# Altium project REFLOW_Controller.PrjPcb (part 1 of 3)
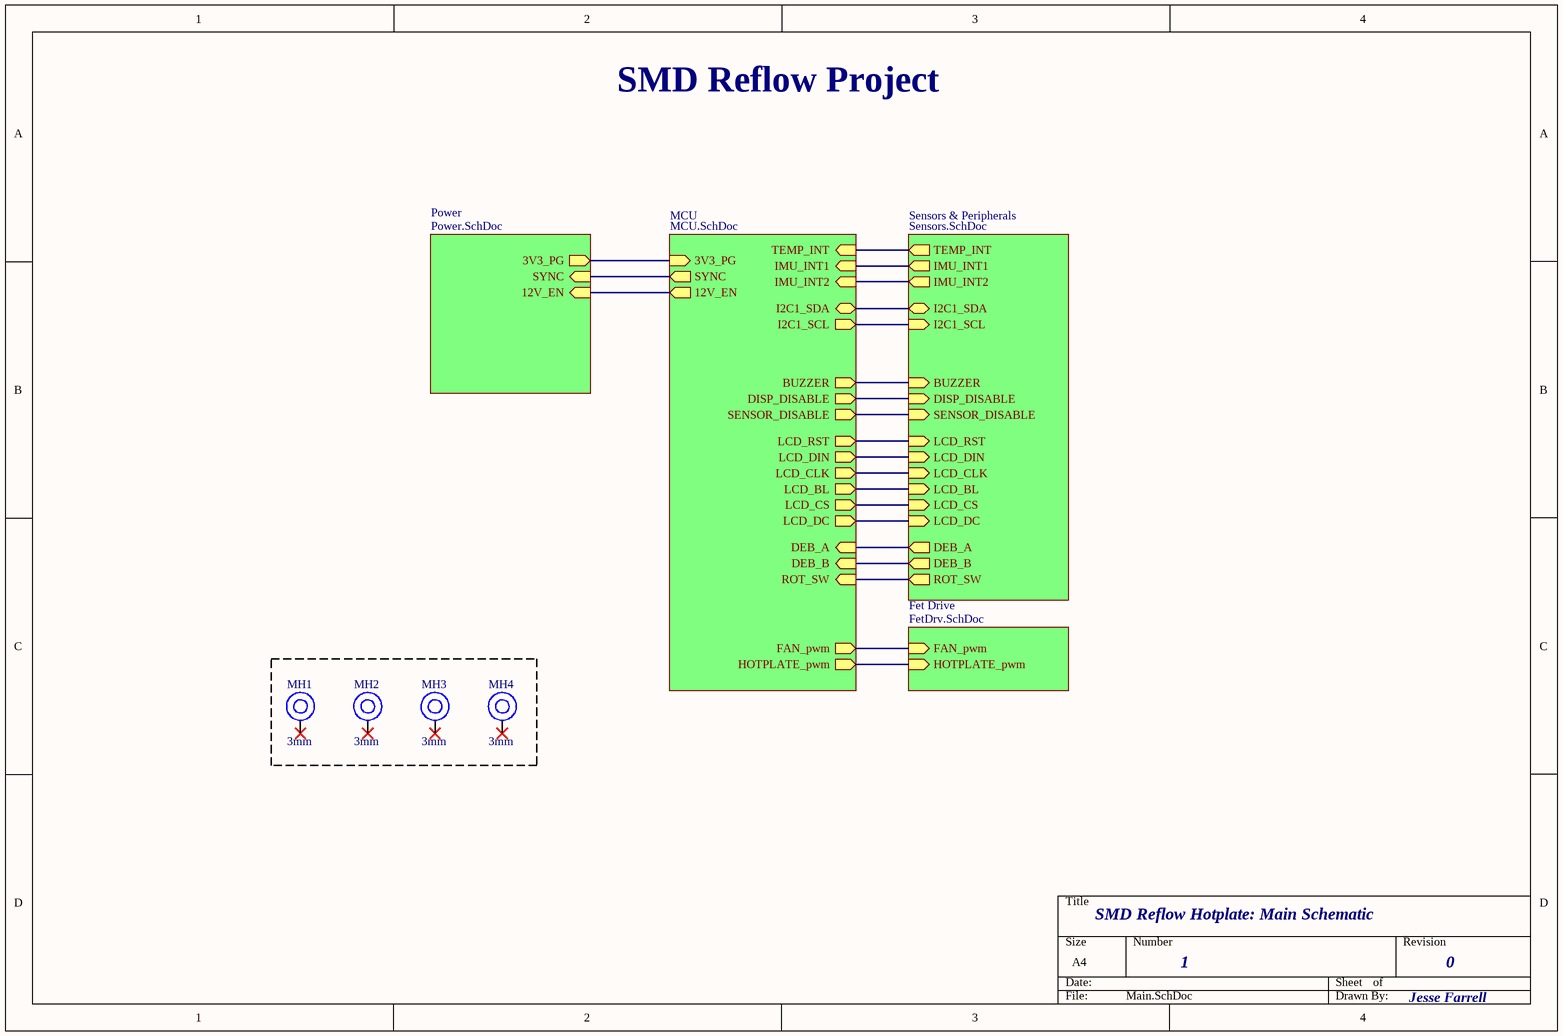
[diagram p0: Main.SchDoc]
5 sheets, 202 parts. Net scope: hierarchical (ports join the sheet entries above them; power ports are global).
Board file: Controller.PcbDoc
Sheets:
  Main.SchDoc
    Power = Power.SchDoc
    MCU = MCU.SchDoc
    Sensors & Peripherals = Sensors.SchDoc
    Fet Drive = FetDrv.SchDoc

## Sheet Main.SchDoc
size A4; SheetNumber: 1; SheetTotal: 5

### Parts
MH1  3mm  [Mount-Hole_3mm]
MH2  3mm  [Mount-Hole_3mm]
MH3  3mm  [Mount-Hole_3mm]
MH4  3mm  [Mount-Hole_3mm]

### Sub-sheets
Fet Drive = FetDrv.SchDoc: FAN_pwm (in), HOTPLATE_pwm (in)
MCU = MCU.SchDoc: SYNC (out), BUZZER (out), 12V_EN (out), 3V3_PG (in), TEMP_INT (in), LCD_CLK (out), LCD_CS (out), LCD_DIN (out), IMU_INT1 (in), LCD_BL (out), LCD_RST (out), LCD_DC (out), ROT_SW (in), DEB_A (in), DEB_B (in), FAN_pwm (out), HOTPLATE_pwm (out), IMU_INT2 (in), I2C1_SCL (out), DISP_DISABLE (out), SENSOR_DISABLE (out), I2C1_SDA (bidir)
Power = Power.SchDoc: 3V3_PG (out), SYNC (in), 12V_EN (in)
Sensors & Peripherals = Sensors.SchDoc: BUZZER (in), TEMP_INT (out), LCD_RST (in), LCD_DIN (in), LCD_CLK (in), LCD_BL (in), LCD_CS (in), LCD_DC (in), DEB_A (out), DEB_B (out), ROT_SW (out), IMU_INT2 (out), IMU_INT1 (out), DISP_DISABLE (in), SENSOR_DISABLE (in), I2C1_SDA (bidir), I2C1_SCL (in)

### Nets
3V3_PG: sheet Power/3V3_PG, sheet MCU/3V3_PG
12V_EN_in: sheet Power/12V_EN, sheet MCU/12V_EN
BUZZER: sheet MCU/BUZZER, sheet Sensors & Peripherals/BUZZER
DEB_A: sheet MCU/DEB_A, sheet Sensors & Peripherals/DEB_A
DEB_B: sheet MCU/DEB_B, sheet Sensors & Peripherals/DEB_B
DISP_DBL: sheet MCU/DISP_DISABLE, sheet Sensors & Peripherals/DISP_DISABLE
FAN_pwm: sheet MCU/FAN_pwm, sheet Fet Drive/FAN_pwm
I2C1_SCL: sheet MCU/I2C1_SCL, sheet Sensors & Peripherals/I2C1_SCL
I2C1_SDA: sheet MCU/I2C1_SDA, sheet Sensors & Peripherals/I2C1_SDA
IMU_INT1: sheet MCU/IMU_INT1, sheet Sensors & Peripherals/IMU_INT1
IMU_INT2: sheet MCU/IMU_INT2, sheet Sensors & Peripherals/IMU_INT2
LCD_BL: sheet MCU/LCD_BL, sheet Sensors & Peripherals/LCD_BL
LCD_CLK: sheet MCU/LCD_CLK, sheet Sensors & Peripherals/LCD_CLK
LCD_CS: sheet MCU/LCD_CS, sheet Sensors & Peripherals/LCD_CS
LCD_DC: sheet MCU/LCD_DC, sheet Sensors & Peripherals/LCD_DC
LCD_DIN: sheet MCU/LCD_DIN, sheet Sensors & Peripherals/LCD_DIN
LCD_RST: sheet MCU/LCD_RST, sheet Sensors & Peripherals/LCD_RST
PLATE_pwm: sheet MCU/HOTPLATE_pwm, sheet Fet Drive/HOTPLATE_pwm
ROT_SW: sheet MCU/ROT_SW, sheet Sensors & Peripherals/ROT_SW
SNS_DBL: sheet MCU/SENSOR_DISABLE, sheet Sensors & Peripherals/SENSOR_DISABLE
SYNC_in: sheet Power/SYNC, sheet MCU/SYNC
TEMP_INT: sheet MCU/TEMP_INT, sheet Sensors & Peripherals/TEMP_INT

Not connected (* = marked no-connect by the designer): MH1 1*; MH2 1*; MH3 1*; MH4 1*

### Notes on the sheet
- SMD Reflow Project
- SMD Reflow Hotplate: Main Schematic
- 1
- 0
- Jesse Farrell

### Library data of the parts
MH1-MH4 = Mount_Hole_3mm: Mounting Hole 3mm plated

## Sheet Power.SchDoc
size A4; SheetNumber: 2; SheetTotal: 5
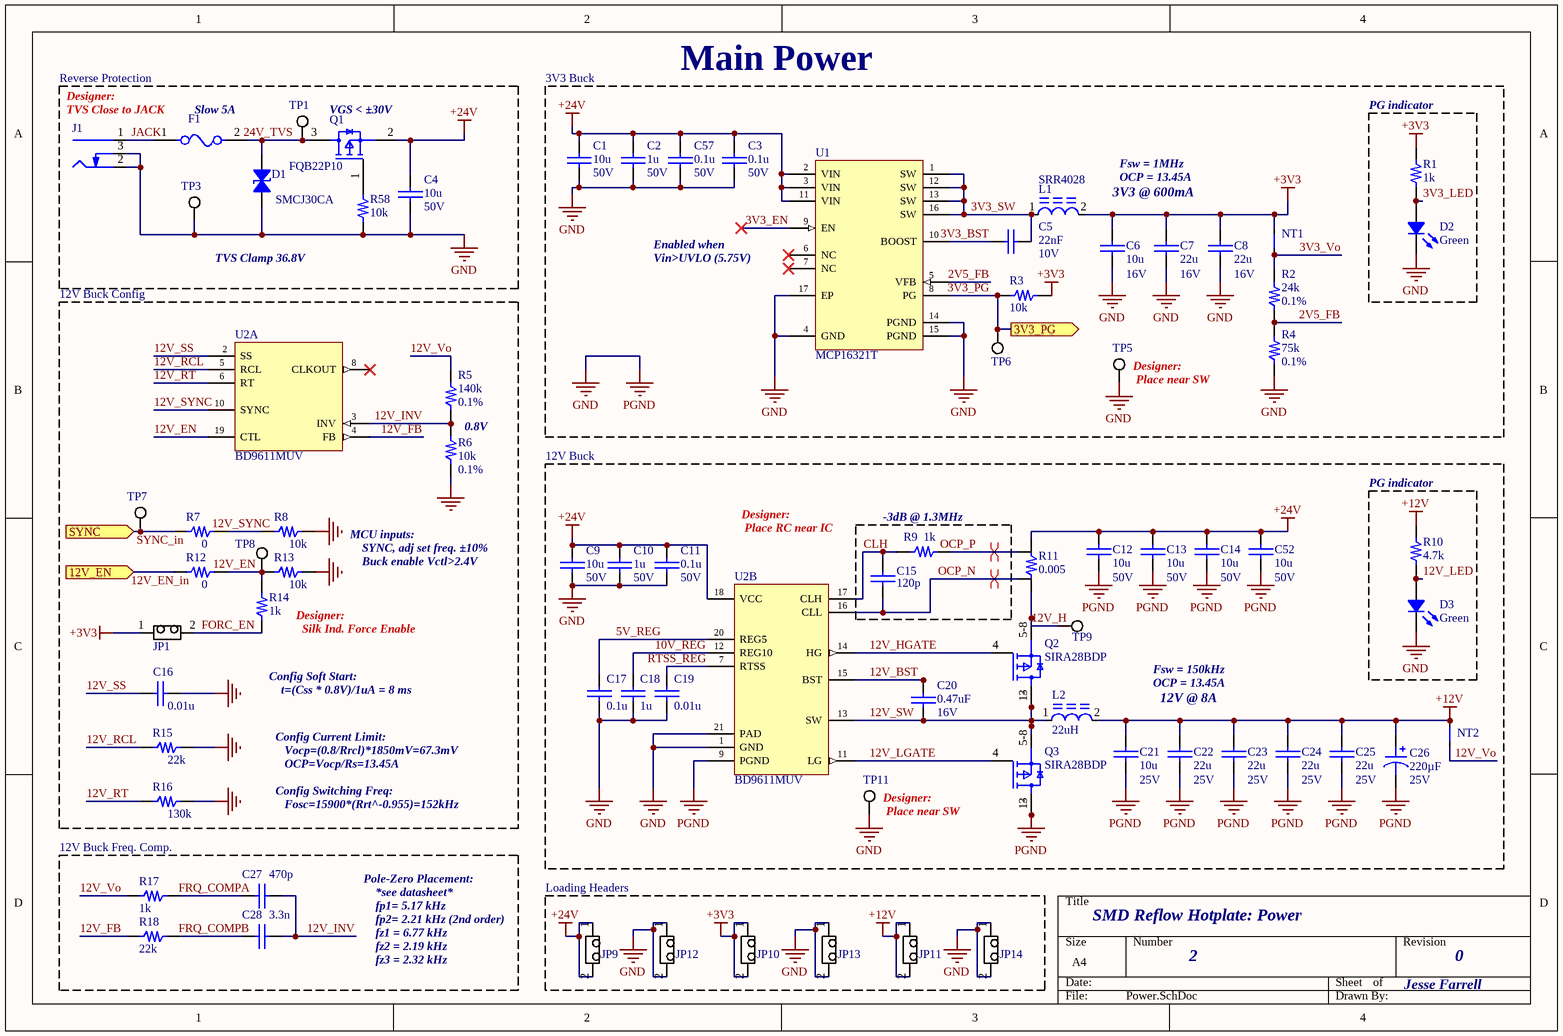
[diagram p1: Power.SchDoc]

### Parts
C1  10u  Voltage Rating: 50V  [FP-CL21-IPC_C]
C2  1u  Voltage Rating: 50V  [FP-CL10-IPC_C]
C3  0.1u  Voltage Rating: 50V  [FP-CL10-IPC_C]
C4  10u  Voltage Rating: 50V  [FP-CL21-IPC_C]
C5  22nF  Voltage Rating: 10V  [FP-CL10-IPC_C]
C6  10u  Voltage Rating: 16V  [FP-CL10-IPC_C]
C7  22u  Voltage Rating: 16V  [FP-CL21-IPC_C]
C8  22u  Voltage Rating: 16V  [FP-CL21-IPC_C]
C9  10u  Voltage Rating: 50V  [FP-CL21-IPC_C]
C10  1u  Voltage Rating: 50V  [FP-CL10-IPC_C]
C11  0.1u  Voltage Rating: 50V  [FP-CL10-IPC_C]
C12  10u  Voltage Rating: 50V  [FP-CL21-IPC_C]
C13  10u  Voltage Rating: 50V  [FP-CL21-IPC_C]
C14  10u  Voltage Rating: 50V  [FP-CL21-IPC_C]
C15  120p  [FP-CL10-IPC_C]
C16  0.01u  [FP-CL10-IPC_C]
C17  0.1u  [FP-CL10-IPC_C]
C18  1u  [FP-CL10-IPC_C]
C19  0.01u  [FP-CL10-IPC_C]
C20  0.47uF  Voltage Rating: 16V  [FP-CL10-IPC_C]
C21  10u  Voltage Rating: 25V  [FP-CL10-IPC_C]
C22  22u  Voltage Rating: 25V  [FP-CL21-IPC_C]
C23  22u  Voltage Rating: 25V  [FP-CL21-IPC_C]
C24  22u  Voltage Rating: 25V  [FP-CL21-IPC_C]
C25  22u  Voltage Rating: 25V  [FP-CL21-IPC_C]
C26  220µF  Voltage - Rated: 25V  [CAP TH ALUM ELEC D8.00mm S3.50mm H13.00mm]
C27  470p  [FP-CL10-IPC_C]
C28  3.3n  [FP-CL10-IPC_C]
C52  10u  Voltage Rating: 50V  [FP-CL21-IPC_C]
C57  0.1u  Voltage Rating: 50V  [FP-CL10-IPC_C]
D1  SMCJ30CA  [DO214AB SMC]
D2  Green  [LED 0603_1608 GREEN]
D3  Green  [LED 0603_1608 GREEN]
F1  SF-1206S600M  [FP-3216FF-MFG]  (value not drawn)
J1  PJ-002AH-SMT-TR  [CUI PJ-002AH-SMT-TR]  (value not drawn)
JP1  HDR_1x2  [FP-TSW-102-07-L-S-MFG]  (value not drawn)
JP9  HDR_1x2  [FP-TSW-102-07-L-S-MFG]  (value not drawn)
JP10  HDR_1x2  [FP-TSW-102-07-L-S-MFG]  (value not drawn)
JP11  HDR_1x2  [FP-TSW-102-07-L-S-MFG]  (value not drawn)
JP12  HDR_1x2  [FP-TSW-102-07-L-S-MFG]  (value not drawn)
JP13  HDR_1x2  [FP-TSW-102-07-L-S-MFG]  (value not drawn)
JP14  HDR_1x2  [FP-TSW-102-07-L-S-MFG]  (value not drawn)
L1  SRR4028  [WE-TPC-4818-M]
L2  22uH  [FP-SRP1265C-MFG]
NT1  Net Tie  [NetTie_10mil]  (value not drawn)  (net tie, no BOM)
NT2  Net Tie  [NetTie_10mil]  (value not drawn)  (net tie, no BOM)
Q1  FQB22P10  [FP-418AJ-MFG]
Q2  SIRA28BDP  [FP-S17-0173-SINGLE-MFG]
Q3  SIRA28BDP  [FP-S17-0173-SINGLE-MFG]
R1  1k  [FP-RMCF0603-MFG]
R2  24k  Tolerance: 0.1%  [FP-RMCF0603-MFG]
R3  10k  [FP-RMCF0603-MFG]
R4  75k  Tolerance: 0.1%  [FP-RMCF0603-MFG]
R5  140k  Tolerance: 0.1%  [FP-RMCF0603-MFG]
R6  10k  Tolerance: 0.1%  [FP-RMCF0603-MFG]
R7  0  [FP-RMCF0603-MFG]
R8  10k  [FP-RMCF0603-MFG]
R9  1k  [FP-RMCF0603-MFG]
R10  4.7k  [FP-RMCF0603-MFG]
R11  0.005  [FP-CSM2512-MFG]
R12  0  [FP-RMCF0603-MFG]
R13  10k  [FP-RMCF0603-MFG]
R14  1k  [FP-RMCF0603-MFG]
R15  22k  [FP-RMCF0603-MFG]
R16  130k  [FP-RMCF0603-MFG]
R17  1k  [FP-RMCF0603-MFG]
R18  22k  [FP-RMCF0603-MFG]
R58  10k  [FP-RMCF0603-MFG]
TP1  TEST POINT  [KSTN-5003]  (value not drawn)
TP3  BLCK TEST POINT  [FP-5001-MFG]  (value not drawn)
TP5  BLCK TEST POINT  [FP-5001-MFG]  (value not drawn)
TP6  TEST POINT  [KSTN-5003]  (value not drawn)
TP7  TEST POINT  [KSTN-5003]  (value not drawn)
TP8  TEST POINT  [KSTN-5003]  (value not drawn)
TP9  TEST POINT  [KSTN-5003]  (value not drawn)
TP11  BLCK TEST POINT  [FP-5001-MFG]  (value not drawn)
U1  MCP16321T  [MCHP-VQFN-NG16_M]
U2  BD9611MUV  [QFN50P400X400X90-21N]  (parts A,B of 2)

### Blocks framed on the sheet
Reverse Protection: C4 D1 F1 J1 Q1 R58 TP1 TP3
Main Power: C1-C3 C5-C8 C57 L1 NT1 R2-R4 TP5 TP6 U1
PG indicator: D2 R1
12V Buck Config: C16 JP1 R5-R8 R12-R16 TP7 TP8 U2
12V @ 8A: C9-C14 C17-C26 C52 L2 NT2 Q2 Q3 R11 TP9 TP11 U2
PG indicator: D3 R10
-3dB @ 1.3MHz: C15 R9
12V Buck Freq. Comp.: C27 C28 R17 R18
Loading Headers: JP9-JP14

### Ports
3V3_PG (out), 12V_EN (in), SYNC (in)

### Nets
+3V3: C6.2 C7.1 C8.1 JP1.1 JP10.1 JP10.2 L1.2 NT1.2 R1.2 R3.1
+12V: C21.2 C22.1 C23.1 C24.1 C25.1 C26.1 JP11.1 JP11.2 L2.2 NT2.2 R10.2
+24V: C1.1 C2.2 C3.2 C4.1 C9.1 C10.2 C11.2 C12.1 C13.1 C14.1 C52.1 C57.2 JP9.1 JP9.2 Q1.2(S) R11.1 U1.2(VIN) U1.3(VIN) U1.11(VIN) U2.18(VCC)
GND: C1.2 C2.1 C3.1 C4.2 C6.1 C7.2 C8.2 C9.2 C10.1 C11.1 C12.2 C13.2 C14.2 C16.2 C17.1 C18.1 C19.1 C21.1 C22.2 C23.2 C24.2 C25.2 C26.2 C52.2 C57.1 D1.1 D2.2 D3.2 J1.2(Outer) J1.3(SW) JP12.1 JP12.2 JP13.1 JP13.2 JP14.1 JP14.2 Q3.1(S) Q3.2(S) Q3.3(S) R4.2 R6.1 R8.1 R13.1 R15.1 R16.1 R58.2 TP3.1 TP5.1 TP11.1 U1.4(GND) U1.14(PGND) U1.15(PGND) U1.17(EP) U2.1(GND) U2.9(PGND) U2.21(PAD)  [also labelled PGND]
2V5_FB: R2.2 R4.1 U1.5(VFB)
3V3_BST: C5.2 U1.10(BOOST)
3V3_EN: U1.9(EN)
3V3_LED: D2.1 R1.1
3V3_PG: R3.2 TP6.1 U1.8(PG) ; port 3V3_PG
3V3_SW: C5.1 L1.1 U1.1(SW) U1.12(SW) U1.13(SW) U1.16(SW)
3V3_Vo: NT1.1 R2.1
5V_REG: C17.2 U2.20(REG5)
10V_REG: C18.2 U2.12(REG10)
12V_BST: C20.1 U2.15(BST)
12V_EN: R12.1 R13.2 R14.1 TP8.1 U2.19(CTL)
12V_EN_in: R12.2 ; port 12V_EN
12V_FB: R18.2 U2.4(FB)
12V_H: Q2.5-8(D) R11.4 TP9.1
12V_HGATE: Q2.4(G) U2.14(HG)
12V_INV: C27.1 C28.1 R5.1 R6.2 U2.3(INV)
12V_LED: D3.1 R10.1
12V_LGATE: Q3.4(G) U2.11(LG)
12V_RCL: R15.2 U2.5(RCL)
12V_RT: R16.2 U2.6(RT)
12V_SS: C16.1 U2.2(SS)
12V_SW: C20.2 L2.1 Q2.1(S) Q2.2(S) Q2.3(S) Q3.5-8(D) U2.13(SW)
12V_SYNC: R7.1 R8.2 U2.10(SYNC)
12V_Vo: NT2.1 R5.2 R17.2
24V_TVS: D1.2 F1.2 Q1.3(S) TP1.1
CLH: C15.2 R9.1 U2.17(CLH)
FORC_EN: JP1.2 R14.2
FRQ_COMPA: C27.2 R17.1
FRQ_COMPB: C28.2 R18.1
JACK: F1.1 J1.1(Centre)
OCP_N: C15.1 R11.2 U2.16(CLL)
OCP_P: R9.2 R11.3
RTSS_REG: C19.2 U2.7(RTSS)
SYNC_in: R7.2 TP7.1 ; port SYNC
NetQ1_1: Q1.1(G) R58.1

Not connected (* = marked no-connect by the designer): U1 6(NC)* 7(NC)*; U2 8(CLKOUT)*

### Layout directives
differential pair: OCP_N, OCP_P

### Notes on the sheet
- Designer:
  TVS Close to JACK
- (near F1) Slow 5A
- VGS < ±30V
- 3V3 Buck
- Fsw = 1MHz
  OCP = 13.45A
- 3V3 @ 600mA
- TVS Clamp 36.8V
- Enabled when
  Vin>UVLO (5.75V)
- (near TP5) Designer:
  Place near SW
- 0.8V
- 12V Buck
- MCU inputs:
  SYNC, adj set freq. ±10%
  Buck enable Vctl>2.4V
- Designer:
  Place RC near IC
- Designer:
  Silk Ind. Force Enable
- (near R14) Config Soft Start:
  t=(Css * 0.8V)/1uA = 8 ms
- Fsw = 150kHz
  OCP = 13.45A
- Config Current Limit:
  Vocp=(0.8/Rrcl)*1850mV=67.3mV
  OCP=Vocp/Rs=13.45A
- Config Switching Freq:
  Fosc=15900*(Rrt^-0.955)=152kHz
- (near TP11) Designer:
  Place near SW
- Pole-Zero Placement:
  *see datasheet*
  fp1= 5.17 kHz
  fp2= 2.21 kHz (2nd order)
  fz1 = 6.77 kHz
  fz2 = 2.19 kHz
  fz3 = 2.32 kHz
- SMD Reflow Hotplate: Power
- 2
- Jesse Farrell
- 0
- (in symbol SIRA28BDP-T1-GE3) 1-

### Library data of the parts
C1 C4 C9 C12-C14 C52 = CapTemplate0805: Cap Ceramic 10uF 50V X5R 10% SMD 0805; Capacitance: 47uF; Tolerance: 20%; Supplier 1: Digi-Key; RoHS: Yes; Category: Ceramic Capacitors; Mount: Surface Mount; Case Code (Imperial): 0805
C2 C10 = CapTemplate0603: Cap Ceramic 1uF 50V X5R 10% SMD 0603; Supplier 1: Digi-Key; RoHS: Yes; Category: Ceramic Capacitors; Mount: Surface Mount; Case/Package: 0603; Case Code (Metric): 1608; Case Code (Imperial): 0603; Packaging: Tape and Reel; Capacitance: 1uF; Tolerance: 10%; Length: 0.063inch; Width: 0.031inch; Thickness: 0.035inch
C3 C11 C57 = CapTemplate0603: Cap Ceramic 0.1uF 50V X5R 10% SMD 0603; Capacitance: 10uF; Supplier 1: Digi-Key; RoHS: Yes; Category: Ceramic Capacitors; Mount: Surface Mount; Case/Package: 0603; Case Code (Metric): 1608; Case Code (Imperial): 0603; Packaging: Tape and Reel; Tolerance: 10%; Length: 0.063inch; Width: 0.031inch; Thickness: 0.035inch
C5 = CapTemplate0603: Cap Ceramic 22nF 10V X7R 10% SMD 0603; Supplier 1: Digi-Key; RoHS: Yes; Category: Ceramic Capacitors; Mount: Surface Mount; Case/Package: 0603; Case Code (Metric): 1608; Case Code (Imperial): 0603; Packaging: Tape and Reel; Capacitance: 22nF; Tolerance: 10%; Length: 0.063inch; Width: 0.031inch; Thickness: 0.035inch
C6 = CapTemplate0603: Cap Ceramic 10uF 16V X5R 10% SMD 0603; Supplier 1: Digi-Key; RoHS: Yes; Category: Ceramic Capacitors; Mount: Surface Mount; Case/Package: 0603; Case Code (Metric): 1608; Case Code (Imperial): 0603; Packaging: Tape and Reel; Capacitance: 10uF; Tolerance: 10%; Length: 0.063inch; Width: 0.031inch; Thickness: 0.035inch
C7 C8 = CapTemplate0805: Cap Ceramic 22uF 16V X5R 10% SMD 0805; Capacitance: 47uF; Tolerance: 20%; Supplier 1: Digi-Key; RoHS: Yes; Category: Ceramic Capacitors; Mount: Surface Mount; Case Code (Imperial): 0805
C15 = CapTemplate0603: Cap Ceramic 120p 16V X7R 10% SMD 0603; Capacitance: ??uF; Voltage Rating: ??V; Tolerance: ??%; Supplier 1: Digi-Key; RoHS: Yes; Category: Ceramic Capacitors; Mount: Surface Mount; Case/Package: 0603; Case Code (Metric): 1608; Case Code (Imperial): 0603; Packaging: Tape and Reel; Length: 0.063inch; Width: 0.031inch; Thickness: 0.035inch
C16 C19 = CapTemplate0603: Cap Ceramic 0.01uF 16V X5R 10% SMD 0603; Capacitance: ??uF; Voltage Rating: ??V; Tolerance: ??%; Supplier 1: Digi-Key; RoHS: Yes; Category: Ceramic Capacitors; Mount: Surface Mount; Case/Package: 0603; Case Code (Metric): 1608; Case Code (Imperial): 0603; Packaging: Tape and Reel; Length: 0.063inch; Width: 0.031inch; Thickness: 0.035inch
C17 = CapTemplate0603: Cap Ceramic 0.1uF 16V X7R 10% SMD 0603; Capacitance: ??uF; Voltage Rating: ??V; Tolerance: ??%; Supplier 1: Digi-Key; RoHS: Yes; Category: Ceramic Capacitors; Mount: Surface Mount; Case/Package: 0603; Case Code (Metric): 1608; Case Code (Imperial): 0603; Packaging: Tape and Reel; Length: 0.063inch; Width: 0.031inch; Thickness: 0.035inch
C18 = CapTemplate0603: Cap Ceramic 1uF 16V X5R 10% SMD 0603; Capacitance: ??uF; Voltage Rating: ??V; Tolerance: ??%; Supplier 1: Digi-Key; RoHS: Yes; Category: Ceramic Capacitors; Mount: Surface Mount; Case/Package: 0603; Case Code (Metric): 1608; Case Code (Imperial): 0603; Packaging: Tape and Reel; Length: 0.063inch; Width: 0.031inch; Thickness: 0.035inch
C20 = CapTemplate0603: Cap Ceramic 0.47uF 16V X7R 10% SMD 0603; Supplier 1: Digi-Key; RoHS: Yes; Category: Ceramic Capacitors; Mount: Surface Mount; Case/Package: 0603; Case Code (Metric): 1608; Case Code (Imperial): 0603; Packaging: Tape and Reel; Capacitance: 0.47uF; Tolerance: 10%; Length: 0.063inch; Width: 0.031inch; Thickness: 0.035inch
C21 = CapTemplate0603: Cap Ceramic 10uF 25V X5R 10% SMD 0603; Supplier 1: Digi-Key; RoHS: Yes; Category: Ceramic Capacitors; Mount: Surface Mount; Case/Package: 0603; Case Code (Metric): 1608; Case Code (Imperial): 0603; Packaging: Tape and Reel; Capacitance: 10uF; Tolerance: 10%; Length: 0.063inch; Width: 0.031inch; Thickness: 0.035inch
C22-C25 = CapTemplate0805: Cap Ceramic 22uF 25V X5R 10% SMD 0805; Capacitance: 47uF; Tolerance: 20%; Supplier 1: Digi-Key; RoHS: Yes; Category: Ceramic Capacitors; Mount: Surface Mount; Case Code (Imperial): 0805
C26 = 860040474004: CAP 220 UF 20% 25 V; manufacturer: Würth Elektronik; Impedance: 150 mOhms; Lifetime @ Temp.: 7000 Hrs @ 105°C; Polarization: Polar; Ripple Current @ High Frequency: 590mA @ 100kHz; Ripple Current @ Low Frequency: 442.5mA @ 120Hz; Part Number: 860040474004; Applications: General Purpose; Capacitance: 220µF; componentlink1description: Datasheet; componentlink1url: https://katalog.we-online.de/pbs/datasheet/860040474004.pdf; componentlink2description: DigiKey Link; componentlink2url: http://digikey.com/product-detail/en/w-rth-elektronik/860040474004/732-9171-1-ND/5729114; Device Package: Radial, Can; Height - Seated (Max): 0.512" (13.00mm); lastupdated: 2020-09-07 5:24:52 AM; Lead Spacing: 0.138" (3.50mm); Lifecycle Status: Active; Minimum Order: 1; Mounting Type: Through Hole; Operating Temperature: -40°C ~ 105°C; Package / Case: Radial, Can; packaging: TapeAndBox; partid: 23788; Part Status: Active; price: 0.19; series: WCAP-ATUL; Size / Dimension: 0.315" Dia (8.00mm); Supplier 1: DigiKey; Supplier Part Number 1: 732-9171-1-ND; Tolerance: ±20%; value: 220µF
C27 = CapTemplate0603: Cap Ceramic 470p 16V X7R 10% SMD 0603; Capacitance: ??uF; Voltage Rating: ??V; Tolerance: ??%; Supplier 1: Digi-Key; RoHS: Yes; Category: Ceramic Capacitors; Mount: Surface Mount; Case/Package: 0603; Case Code (Metric): 1608; Case Code (Imperial): 0603; Packaging: Tape and Reel; Length: 0.063inch; Width: 0.031inch; Thickness: 0.035inch
C28 = CapTemplate0603: Cap Ceramic 3.3n 16V X7R 10% SMD 0603; Capacitance: ??uF; Voltage Rating: ??V; Tolerance: ??%; Supplier 1: Digi-Key; RoHS: Yes; Category: Ceramic Capacitors; Mount: Surface Mount; Case/Package: 0603; Case Code (Metric): 1608; Case Code (Imperial): 0603; Packaging: Tape and Reel; Length: 0.063inch; Width: 0.031inch; Thickness: 0.035inch
D1 = SMCJ30CA: TVS DIODE 30VWM 48.4VC SMC; Manufacturer: Taiwan Semiconductor Corporation; Bidirectional Channels: 1; Current - Peak Pulse (10/1000µs): 31A; Power Line Protection: No; Power - Peak Pulse: 1500W (1.5kW); Type: Zener; Voltage - Breakdown (Min): 33.3V; Voltage - Clamping (Max) @ Ipp: 48.4V; Voltage - Reverse Standoff (Typ): 30V; Part Number: SMCJ30CA; Applications: General Purpose; ComponentLink1Description: Datasheet; ComponentLink1URL: https://www.taiwansemi.com/products/datasheet/SMCJ5V0CA_F%20SERIES_A1806.pdf; ComponentLink2Description: DigiKey Link; ComponentLink2URL: https://www.digikey.com/en/products/detail/taiwan-semiconductor-corporation/SMCJ30CA/1052591; LastUpdated: 2022-05-23 1:51:17 PM; Lifecycle Status: Active; Minimum Order: 1; Mounting Type: Surface Mount; Package / Case: DO-214AB, SMC; Packaging: TapeAndReel; PartId: 8125; Part Status: Active; Price: 0.38; Series: -; Supplier 1: DigiKey; Supplier Part Number 1: SMCJ30CAFSCT-ND; Supplier Device Package: SMC (DO-214AB)
D2 D3 = AA1608CGSK: 1.6X0.8MM GREEN SMD LED; Manufacturer: Kingbright; Current - Test: 20mA; Lens Color: Colorless; Lens Style: Rectangle with Flat Top; Lens Transparency: Clear; Millicandela Rating: 75mcd; Viewing Angle: 120°; Voltage - Forward (Vf) (Typ): 2.1V; Wavelength - Dominant: 570nm; Wavelength - Peak: 574nm; Part Number: AA1608CGSK; Color: Green; ComponentLink1Description: Datasheet; ComponentLink1URL: https://www.kingbrightusa.com/images/catalog/SPEC/AA1608CGSK.pdf; ComponentLink2Description: DigiKey Link; ComponentLink2URL: https://www.digikey.com/en/products/detail/kingbright/AA1608CGSK/13679426; Device Package: 0603 (1608 Metric); Height (Max): 0.70mm; LastUpdated: 2022-06-12 5:46:55 PM; Lifecycle Status: Active; Minimum Order: 1; Mounting Type: Surface Mount; Package / Case: 0603 (1608 Metric); Packaging: TapeAndReel; PartId: 995; Part Status: Active; Price: 0.12; Series: -; Size / Dimension: 1.60mm L x 0.80mm W; Supplier 1: DigiKey; Supplier Part Number 1: 754-AA1608CGSKCT-ND; Supplier Device Package: 0603; Value: Green
F1 = SF-1206S600M-2: Fuse Chip Slow Blow Acting 6A 32V Solder Pad SMD 1206 3.2 X 1.6 X 0.85mm Ceramic; Manufacturer: Bourns; Fuse Type: Board Mount (Cartridge Style Excluded); DC Cold Resistance: 13mR; Supplier 1: Digi-Key; Manufacturer Part Number: SF-1206S600M-2; RoHS: Yes; Category: Fuses; Stock 1: 22080; Mount: Surface Mount; Case/Package: 1206; Case Code (Imperial): 1206; Case Code (Metric): 3216; Min Operating Temperature: -55°C; Max Operating Temperature: 125°C; Packaging: Cut Tape; Current Rating: 6A; Voltage Rating (DC): 32V; ComponentLink1URL: https://www.bourns.com/docs/Product-Datasheets/SF-1206SxxxM.pdf?src-supplier=Digi-Key; ComponentLink1Description: https://www.bourns.com/docs/Product-Datasheets/SF-1206SxxxM.pdf?src-supplier=Digi-Key; Supplier Part Number 1: SF-1206S600M-2CT-ND
J1 = PJ-002AH-SMT-TR: CONN PWR JACK 2X5.5MM SOLDER; Manufacturer: CUI Devices; Actual Diameter: 0.079" (2.00mm ID), 0.256" (6.50mm OD); Current Rating (Amps): 5A; Gender: Male; Industry Recognized Mating Diameter: 2.00mm ID (0.079"), 5.50mm OD (0.217"); Internal Switch(s): Single Switch, Normally Closed; Material Flammability Rating: UL94 V-0; Mating Length/Depth: 0.350" (8.90mm); Number of Positions/Contacts: 2 Conductors, 3 Contacts; Shielding: Unshielded; Voltage - Rated: 24VDC; Part Number: PJ-002AH-SMT-TR; ComponentLink1Description: Datasheet; ComponentLink1URL: https://www.cuidevices.com/product/resource/digikeypdf/pj-002ah-smt-tr.pdf; ComponentLink2Description: DigiKey Link; ComponentLink2URL: http://digikey.com/product-detail/en/cui-devices/PJ-002AH-SMT-TR/CP-002AHPJCT-ND/669692; Connector Type: Jack; Features: Board Guide; LastUpdated: 2020-05-26 1:33:39 PM; Lifecycle Status: Active; Minimum Order: 1; Mounting Type: Surface Mount; Packaging: TapeAndReel; Part Status: Active; Price: 0.90; Series: -; Supplier 1: DigiKey; Supplier Part Number 1: CP-002AHPJCT-ND; Termination: Solder
JP1 JP9-JP14 = PH1-02-UA: Conn Unshrouded Header HDR 2 POS 2.54mm Solder ST Thru-Hole Bag; Manufacturer: Adam Equipment; Current Rating: 3A; Voltage Rating: 250V; Number of Positions: 2; Supplier 1: Digi-Key; Manufacturer Part Number: PH1-02-UA; RoHS: Yes; Category: Connectors; Stock 1: 124311; Contact Material: Brass; Contact Plating: Gold; Housing Material: PBT; Contact Gender: Male; Number of Rows: 1; Termination: Solder; Pitch: 2.54mm; Lead Free: Lead Free; ComponentLink1URL: https://datasheet.ciiva.com/16392/ph1-xx-ua-16392701.pdf?src-supplier=Future+Electronics; ComponentLink1Description: https://datasheet.ciiva.com/16392/ph1-xx-ua-16392701.pdf?src-supplier=Future+Electronics; ComponentLink2URL: https://datasheet.ciiva.com/5160/page-292-295-12946-5160830.pdf?src-supplier=Mouser; ComponentLink2Description: https://datasheet.ciiva.com/5160/page-292-295-12946-5160830.pdf?src-supplier=Mouser; Supplier Part Number 1: 2057-PH1-02-UA-ND
L1 = SRR4028-120Y: Inductor Power Shielded Wirewound 12uH 30% 100KHz 11.26Q-Factor Ferrite 1.12A 0.125Ohm DCR T/R; Manufacturer: Bourns; Self Resonant Frequency: 25MHz; Saturation Current: 850mA; Q Factor: 11.26; DC Resistance (DCR): 125mR; Supplier 1: Digi-Key; Manufacturer Part Number: SRR4028-120Y; RoHS: Yes; Category: Fixed Inductors; Stock 1: 4196; Mount: Surface Mount; Case/Package: 1919; Core Material: Ferrite; Case Code (Metric): 4848; Case Code (Imperial): 1919; Min Operating Temperature: -40°C; Max Operating Temperature: 125°C; Package Quantity: 500; Packaging: Tape and Reel; Tolerance: 30%; Shielding: Shielded; Current Rating: 1.12A; Resistor Type: Wirewound; Inductance: 12uH; Test Frequency: 100kHz; Max DC Current: 1.12A; Termination: SMD/SMT; DC Current: 1.12A; Series: SRR4028; RMS Current (Irms): 1.12A; Inductance Tolerance: 30%; Length: 0.189inch; Width: 0.189inch; Height: 2.8mm; Height - Seated (Max): 0.118inch; Depth: 5mm; Military Standard: Not; REACH SVHC: No SVHC; RoHS Compliant: Yes; ComponentLink1URL: https://datasheet.ciiva.com/1070/srr4028-1070677.pdf?src-supplier=Digi-Key; ComponentLink1Description: https://datasheet.ciiva.com/1070/srr4028-1070677.pdf?src-supplier=Digi-Key; ComponentLink2URL: https://datasheet.ciiva.com/1070/srr4028-1070678.pdf?src-supplier=Digi-Key; ComponentLink2Description: https://datasheet.ciiva.com/1070/srr4028-1070678.pdf?src-supplier=Digi-Key; ComponentLink3URL: https://datasheet.ciiva.com/48684/srr4028-48684811.pdf?src-supplier=Avnet; ComponentLink3Description: https://datasheet.ciiva.com/48684/srr4028-48684811.pdf?src-supplier=Avnet; Supplier Part Number 1: SRR4028-120YCT-ND
L2 = SRP1265C-220M: Ind Power Shielded Wirewound 22uH 20% 100kHz 20@100KHz Q-Factor Alloy Powder 10A T/R; Manufacturer: Bourns; Supplier 1: Digi-Key; Manufacturer Part Number: SRP1265C-220M; RoHS: No; Category: Fixed Inductors; Stock 1: 205; Supplier Part Number 1: 118-SRP1265C-220MCT-ND
NT1 NT2 = NetTie_10mil: Net Tie with 10mil trace
Q1 = FQB22P10TM: Trans MOSFET P-CH 100V 22A 3-Pin(2+Tab) D2PAK T/R / MOSFET P-CH 100V 22A D2PAK; Manufacturer: ON Semiconductor / Fairchild; Rds On Max: 125mR; Input Capacitance: 1.5nF; Max Power Dissipation: 3.75W; Element Configuration: Single; Polarity: P-CHANNEL; Rise Time: 170ns; Number of Elements: 1; Fall Time: 110ns; Turn-Off Delay Time: 60ns; Turn-On Delay Time: 17ns; Drain to Source Breakdown Voltage: -100V; Gate to Source Voltage (Vgs): 30V; Current Rating: -22A; Threshold Voltage: -4V; Supplier 1: Digi-Key; Manufacturer Part Number: FQB22P10TM; RoHS: Yes; Category: MOSFETs; Stock 1: 10749; Mount: Surface Mount; Case/Package: D2PAK; Number of Pins: 3; Weight: 1.31247g; Contact Plating: Tin,Matte; Min Operating Temperature: -55°C; Max Operating Temperature: 175°C; Packaging: Tape and Reel; Package Quantity: 1; Drain to Source Voltage (Vdss): 100V; Continuous Drain Current (ID): 22A; Power Dissipation: 3.75W; Series: QFET®; Drain to Source Resistance: 125mR; Voltage Rating (DC): -100V; On-State Resistance: 125mR; Drain-source On Resistance-Max: 125mR; Dual Supply Voltage: 100V; Termination: SMD/SMT; Length: 10.67mm; Width: 9.65mm; Height: 4.83mm; Radiation Hardening: No; RoHS Compliant: Yes; Lead Free: Lead Free; REACH SVHC: No SVHC; ComponentLink1URL: https://datasheet.ciiva.com/6367/fqb22p10-6367938.pdf?src-supplier=Digi-Key; ComponentLink1Description: https://datasheet.ciiva.com/6367/fqb22p10-6367938.pdf?src-supplier=Digi-Key; ComponentLink2URL: https://datasheet.ciiva.com/4444/fqb22p10-107751-4444638.pdf?src-supplier=Mouser; ComponentLink2Description: https://datasheet.ciiva.com/4444/fqb22p10-107751-4444638.pdf?src-supplier=Mouser; ComponentLink3URL: https://datasheet.ciiva.com/1256/fqb22p10tm-f085-1256194.pdf?src-supplier=Newark; ComponentLink3Description: https://datasheet.ciiva.com/1256/fqb22p10tm-f085-1256194.pdf?src-supplier=Newark; ComponentLink4URL: https://datasheet.ciiva.com/22671/1725653-22671974.pdf?src-supplier=Element14; ComponentLink4Description: https://datasheet.ciiva.com/22671/1725653-22671974.pdf?src-supplier=Element14; ComponentLink5URL: https://datasheet.ciiva.com/23855/32226-23855422.pdf?src-supplier=Newark; ComponentLink5Description: https://datasheet.ciiva.com/23855/32226-23855422.pdf?src-supplier=Newark; ComponentLink6URL: https://datasheet.ciiva.com/23855/1774687-23855440.pdf?src-supplier=Newark; ComponentLink6Description: https://datasheet.ciiva.com/23855/1774687-23855440.pdf?src-supplier=Newark; ComponentLink7URL: https://datasheet.ciiva.com/8114/fqb22p10-8114733.pdf?src-supplier=Avnet; ComponentLink7Description: https://datasheet.ciiva.com/8114/fqb22p10-8114733.pdf?src-supplier=Avnet; ComponentLink8URL: https://datasheet.ciiva.com/8115/fqb22p10-8115927.pdf?src-supplier=Avnet; ComponentLink8Description: https://datasheet.ciiva.com/8115/fqb22p10-8115927.pdf?src-supplier=Avnet; ComponentLink9URL: https://datasheet.ciiva.com/16746/fqb22p10-16746094.pdf?src-supplier=Future+Electronics; ComponentLink9Description: https://datasheet.ciiva.com/16746/fqb22p10-16746094.pdf?src-supplier=Future+Electronics; ComponentLink10URL: https://datasheet.ciiva.com/46382/1774687-46382844.pdf?src-supplier=Element14; ComponentLink10Description: https://datasheet.ciiva.com/46382/1774687-46382844.pdf?src-supplier=Element14; ComponentLink11URL: https://datasheet.ciiva.com/22671/1774687-22671821.pdf?src-supplier=Element14; ComponentLink11Description: https://datasheet.ciiva.com/22671/1774687-22671821.pdf?src-supplier=Element14; ComponentLink12URL: https://datasheet.ciiva.com/48701/001264110-da-01-en-mosfet-p-ch-100v-fqb22p10tm-to-263-3-fsc-48701143.pdf?src-supplier=Conrad; ComponentLink12Description: https://datasheet.ciiva.com/48701/001264110-da-01-en-mosfet-p-ch-100v-fqb22p10tm-to-263-3-fsc-48701143.pdf?src-supplier=Conrad; Supplier Part Number 1: FQB22P10TMCT-ND
Q2 Q3 = SIRA28BDP-T1-GE3: Trans MOSFET N-CH 30V 18A 8-Pin PowerPAK SO EP T/R; Manufacturer: Vishay; Supplier 1: Digi-Key; Manufacturer Part Number: SIRA28BDP-T1-GE3; RoHS: Yes; Stock 1: 1312; Supplier Part Number 1: SIRA28BDP-T1-GE3CT-ND
R1 = ResTemplate0603: Res 0603 1K Ohm 1% 1/8W; Tolerance: ???%; Power Rating: ???mW; Resistance: ???; Supplier 1: Digi-Key; Category: Chip SMD Resistors; Mount: Surface Mount; Case/Package: 0603; Case Code (Metric): 1608; Case Code (Imperial): 0603; Number of Terminations: 2; Length: 0.061inch; Width: 0.031inch; Height: 0.022inch
R2 = ResTemplate0603: Res 0603 24K Ohm 0.1% 1/10W; Power Rating: ???mW; Resistance: ???; Supplier 1: Digi-Key; Category: Chip SMD Resistors; Mount: Surface Mount; Case/Package: 0603; Case Code (Metric): 1608; Case Code (Imperial): 0603; Number of Terminations: 2; Length: 0.061inch; Width: 0.031inch; Height: 0.022inch
R3 R8 R13 R58 = ResTemplate0603: Res 0603 10K Ohm 1% 1/10W; Tolerance: ???%; Power Rating: ???mW; Resistance: ???; Supplier 1: Digi-Key; Category: Chip SMD Resistors; Mount: Surface Mount; Case/Package: 0603; Case Code (Metric): 1608; Case Code (Imperial): 0603; Number of Terminations: 2; Length: 0.061inch; Width: 0.031inch; Height: 0.022inch
R4 = ResTemplate0603: Res 0603 75K Ohm 0.1% 1/10W; Power Rating: ???mW; Resistance: ???; Supplier 1: Digi-Key; Category: Chip SMD Resistors; Mount: Surface Mount; Case/Package: 0603; Case Code (Metric): 1608; Case Code (Imperial): 0603; Number of Terminations: 2; Length: 0.061inch; Width: 0.031inch; Height: 0.022inch
R5 = ResTemplate0603: Res 0603 140K Ohm 0.1% 1/10W; Power Rating: ???mW; Resistance: ???; Supplier 1: Digi-Key; Category: Chip SMD Resistors; Mount: Surface Mount; Case/Package: 0603; Case Code (Metric): 1608; Case Code (Imperial): 0603; Number of Terminations: 2; Length: 0.061inch; Width: 0.031inch; Height: 0.022inch
R6 = ResTemplate0603: Res 0603 10K Ohm 0.1% 1/10W; Power Rating: ???mW; Resistance: ???; Supplier 1: Digi-Key; Category: Chip SMD Resistors; Mount: Surface Mount; Case/Package: 0603; Case Code (Metric): 1608; Case Code (Imperial): 0603; Number of Terminations: 2; Length: 0.061inch; Width: 0.031inch; Height: 0.022inch
R7 R12 = ResTemplate0603: Res 0603 0 Ohm 1% 1/10W; Tolerance: ???%; Power Rating: ???mW; Resistance: ???; Supplier 1: Digi-Key; Category: Chip SMD Resistors; Mount: Surface Mount; Case/Package: 0603; Case Code (Metric): 1608; Case Code (Imperial): 0603; Number of Terminations: 2; Length: 0.061inch; Width: 0.031inch; Height: 0.022inch
R9 R14 R17 = ResTemplate0603: Res 0603 1K Ohm 1% 1/10W; Tolerance: ???%; Power Rating: ???mW; Resistance: ???; Supplier 1: Digi-Key; Category: Chip SMD Resistors; Mount: Surface Mount; Case/Package: 0603; Case Code (Metric): 1608; Case Code (Imperial): 0603; Number of Terminations: 2; Length: 0.061inch; Width: 0.031inch; Height: 0.022inch
R10 = ResTemplate0603: Res 0603 4.7K Ohm 1% 1/8W; Tolerance: ???%; Power Rating: ???mW; Resistance: ???; Supplier 1: Digi-Key; Category: Chip SMD Resistors; Mount: Surface Mount; Case/Package: 0603; Case Code (Metric): 1608; Case Code (Imperial): 0603; Number of Terminations: 2; Length: 0.061inch; Width: 0.031inch; Height: 0.022inch
R11 = WSK25125L000FEA: Res Metal Strip 2512 0.005 Ohm 1% 1W ±35ppm/°C Molded SMD SMD T/R; Manufacturer: Vishay; Resistance: 5mR; Voltage Rating: 70mV; Supplier 1: Digi-Key; Manufacturer Part Number: WSK25125L000FEA; RoHS: Yes; Category: Chip SMD Resistors; Stock 1: 215; Case/Package: 2512; Case Code (Imperial): 2512; Case Code (Metric): 6432; Contact Plating: Tin,Matte; Size Code: 2512; Min Operating Temperature: -65°C; Max Operating Temperature: 170°C; Packaging: Tape and Reel; Package Quantity: 2000; Tolerance: 1%; Power Rating: 1W; Resistor Type: Metal Strip; Termination: SMD/SMT; Temperature Coefficient: 35ppm/°C; Series: WSK; Resistance Tolerance: 1%; Construction: Rectangular; Technology: METAL STRIP; Length: 6.35mm; Width: 3.2mm; Height: 0.635mm; Depth: 3.18mm; Radiation Hardening: No; REACH SVHC: No SVHC; Military Standard: Not; Lead Free: Lead Free; RoHS Compliant: Yes; ComponentLink1URL: https://datasheet.ciiva.com/12918/wsk-239745-12918336.pdf?src-supplier=Mouser; ComponentLink1Description: https://datasheet.ciiva.com/12918/wsk-239745-12918336.pdf?src-supplier=Mouser; ComponentLink2URL: https://datasheet.ciiva.com/11811/0900766b80d81ded-11811620.pdf?src-supplier=RSComponents; ComponentLink2Description: https://datasheet.ciiva.com/11811/0900766b80d81ded-11811620.pdf?src-supplier=RSComponents; ComponentLink3URL: https://datasheet.ciiva.com/9068/wsk-9068606.pdf?src-supplier=Avnet; ComponentLink3Description: https://datasheet.ciiva.com/9068/wsk-9068606.pdf?src-supplier=Avnet; ComponentLink4URL: https://datasheet.ciiva.com/16510/wsk-16510155.pdf?src-supplier=Future+Electronics; ComponentLink4Description: https://datasheet.ciiva.com/16510/wsk-16510155.pdf?src-supplier=Future+Electronics; ComponentLink5URL: https://datasheet.ciiva.com/7702/442632-7702444.pdf?src-supplier=Element14; ComponentLink5Description: https://datasheet.ciiva.com/7702/442632-7702444.pdf?src-supplier=Element14; Supplier Part Number 1: 541-WSK25125L000FEACT-ND
R15 R18 = ResTemplate0603: Res 0603 22K Ohm 1% 1/10W; Tolerance: ???%; Power Rating: ???mW; Resistance: ???; Supplier 1: Digi-Key; Category: Chip SMD Resistors; Mount: Surface Mount; Case/Package: 0603; Case Code (Metric): 1608; Case Code (Imperial): 0603; Number of Terminations: 2; Length: 0.061inch; Width: 0.031inch; Height: 0.022inch
R16 = ResTemplate0603: Res 0603 130K Ohm 1% 1/10W; Tolerance: ???%; Power Rating: ???mW; Resistance: ???; Supplier 1: Digi-Key; Category: Chip SMD Resistors; Mount: Surface Mount; Case/Package: 0603; Case Code (Metric): 1608; Case Code (Imperial): 0603; Number of Terminations: 2; Length: 0.061inch; Width: 0.031inch; Height: 0.022inch
TP1 TP6-TP9 = 5003: Test Point;  Miniature;  THM;  H .300;  Nylon 46 Insulated Orange;  PhosBronze/Silver; Manufacturer: Keystone Electronics; Body Material: PBT; Plating: Silver; Inside Diameter: 1.27mm; Outside Diameter: 2.54mm; Supplier 1: Digi-Key; Manufacturer Part Number: 5003; RoHS: Yes; Category: Connectors; Stock 1: 166018; Mount: PCB,Through Hole; Number of Pins: 1; Contact Material: Bronze; Contact Plating: Silver,Tin; Material: Nylon,Bronze,Silver; Color: Orange,White; Package Quantity: 10; Packaging: Bulk; Series: THM; Termination: Through Hole; Length: 7.62mm; Height: 0.3inch; REACH SVHC: No SVHC; Lead Free: Lead Free; RoHS Compliant: Yes; Flammability Rating: UL94 V-0; ComponentLink1URL: https://datasheet.ciiva.com/16885/70182825-16885788.pdf?src-supplier=Allied+Electronics; ComponentLink1Description: https://datasheet.ciiva.com/16885/70182825-16885788.pdf?src-supplier=Allied+Electronics; ComponentLink2URL: https://datasheet.ciiva.com/1454/1703983-1454826.pdf?src-supplier=Element14; ComponentLink2Description: https://datasheet.ciiva.com/1454/1703983-1454826.pdf?src-supplier=Element14; ComponentLink3URL: https://datasheet.ciiva.com/22631/1703983-22631103.pdf?src-supplier=Element14; ComponentLink3Description: https://datasheet.ciiva.com/22631/1703983-22631103.pdf?src-supplier=Element14; ComponentLink4URL: https://datasheet.ciiva.com/4598/5000-5004-4598618.pdf?src-supplier=Mouser; ComponentLink4Description: https://datasheet.ciiva.com/4598/5000-5004-4598618.pdf?src-supplier=Mouser; Supplier Part Number 1: 36-5003-ND
TP3 TP5 TP11 = 5001: TEST POINT PC MINI .040D BLACK; Manufacturer: Keystone Electronics; Body Material: Bronze; Plating: Silver; Number of Ports: 1; Insulation: Insulated; Inside Diameter: 1.27mm; Outside Diameter: 2.54mm; Hole Diameter: 1.6mm; Supplier 1: Digi-Key; Manufacturer Part Number: 5001; RoHS: Yes; Category: Test Probes, Leads and Clips; Stock 1: 1368499; Mount: Through Hole; Contact Material: Bronze; Contact Plating: Silver,Tin; Material: Nylon,Bronze,Silver; Color: Black; Insulation Material: Nylon; Housing Color: Black; Package Quantity: 100; Packaging: Bulk; Series: THM; Termination: Through Hole; Orientation: Straight; Number of Contacts: 1; Diameter: 2.54mm; Length: 7.62mm; Height: 0.3inch; REACH SVHC: No SVHC; Lead Free: Lead Free; RoHS Compliant: Yes; Flammability Rating: UL94 V-0; ComponentLink1URL: https://datasheet.ciiva.com/11836/0900766b8009b7c7-11836045.pdf?src-supplier=RSComponents; ComponentLink1Description: https://datasheet.ciiva.com/11836/0900766b8009b7c7-11836045.pdf?src-supplier=RSComponents; ComponentLink2URL: https://datasheet.ciiva.com/27052/1581986-27052611.pdf?src-supplier=Jameco; ComponentLink2Description: https://datasheet.ciiva.com/27052/1581986-27052611.pdf?src-supplier=Jameco; ComponentLink3URL: https://datasheet.ciiva.com/16318/m60-2p60-16318423.pdf?src-supplier=Future+Electronics; ComponentLink3Description: https://datasheet.ciiva.com/16318/m60-2p60-16318423.pdf?src-supplier=Future+Electronics; ComponentLink4URL: https://datasheet.ciiva.com/22631/1703983-22631100.pdf?src-supplier=Element14; ComponentLink4Description: https://datasheet.ciiva.com/22631/1703983-22631100.pdf?src-supplier=Element14; Supplier Part Number 1: 36-5001-ND
U1 = MCP16321T-250E/NG: High efficiency 1MHZ 1A current Mode Synchronous Buck DC/DC converter; Manufacturer: Microchip; Min Input Voltage: 6V; Max Input Voltage: 24V; Efficiency: 95%; Output Voltage: 2.5V; Number of Outputs: 1; Switching Frequency: 1.1MHz; Max Duty Cycle: 99%; Isolation: Isolated; Output Type: Fixed; Supplier 1: Digi-Key; Manufacturer Part Number: MCP16321T-250E/NG; RoHS: Yes; Category: Voltage Regulators - Switching; Stock 1: 1888; Mount: Surface Mount; Case/Package: QFN; Number of Pins: 16; Min Operating Temperature: -40°C; Max Operating Temperature: 125°C; Output Current: 1A; Packaging: Tape and Reel; Package Quantity: 3300; Max Output Current: 1A; Operating Supply Current: 1A; Operating Supply Voltage: 24V; Radiation Hardening: No; RoHS Compliant: Yes; ComponentLink1URL: https://datasheet.ciiva.com/2024/22285a-2024272.pdf?src-supplier=Digi-Key; ComponentLink1Description: https://datasheet.ciiva.com/2024/22285a-2024272.pdf?src-supplier=Digi-Key; ComponentLink2URL: https://datasheet.ciiva.com/3232/22285a-3232070.pdf?src-supplier=Avnet; ComponentLink2Description: https://datasheet.ciiva.com/3232/22285a-3232070.pdf?src-supplier=Avnet; ComponentLink3URL: https://datasheet.ciiva.com/12211/22285a-71486-12211529.pdf?src-supplier=Mouser; ComponentLink3Description: https://datasheet.ciiva.com/12211/22285a-71486-12211529.pdf?src-supplier=Mouser; Supplier Part Number 1: MCP16321T-250E/NGCT-ND
U2 = BD9611MUV-E2: 60V Synchronous Step-down Switching Regulator, VQFN020V4040, RoHS; Manufacturer: Rohm; Switching Frequency: 500kHz; Output Voltage: 44.8V; Number of Outputs: 1; Synchronous Rectifier: Yes; Min Input Voltage: 10V; Max Input Voltage: 56V; Output Configuration: Positive; Output Type: Adjustable; Supplier 1: Digi-Key; Manufacturer Part Number: BD9611MUV-E2; RoHS: Yes; Category: Voltage Regulators - Switching; Stock 1: 4289; Mount: Surface Mount; Number of Pins: 20; Contact Plating: Copper,Tin; Min Operating Temperature: -40°C; Max Operating Temperature: 105°C; Packaging: Tape and Reel; Number of Output Phases: 1; Clock Sync: Yes; Operating Supply Voltage: 56V; Lead Free: Lead Free; RoHS Compliant: Yes; ComponentLink1URL: http://www.mouser.com/ds/2/348/bd9611muv-e-596679.pdf?src-supplier=Mouser; ComponentLink1Description: http://www.mouser.com/ds/2/348/bd9611muv-e-596679.pdf?src-supplier=Mouser; ComponentLink2URL: http://rohmfs.rohm.com/en/products/databook/datasheet/ic/power/switching_regulator/bd9611muv-e.pdf?src-supplier=Avnet; ComponentLink2Description: http://rohmfs.rohm.com/en/products/databook/datasheet/ic/power/switching_regulator/bd9611muv-e.pdf?src-supplier=Avnet; ComponentLink3URL: http://rohmfs.rohm.com/en/products/databook/datasheet/ic/power/switching_regulator/bd9611muv-e.pdf?src-supplier=Digi-Key; ComponentLink3Description: http://rohmfs.rohm.com/en/products/databook/datasheet/ic/power/switching_regulator/bd9611muv-e.pdf?src-supplier=Digi-Key; Supplier Part Number 1: BD9611MUV-E2CT-ND